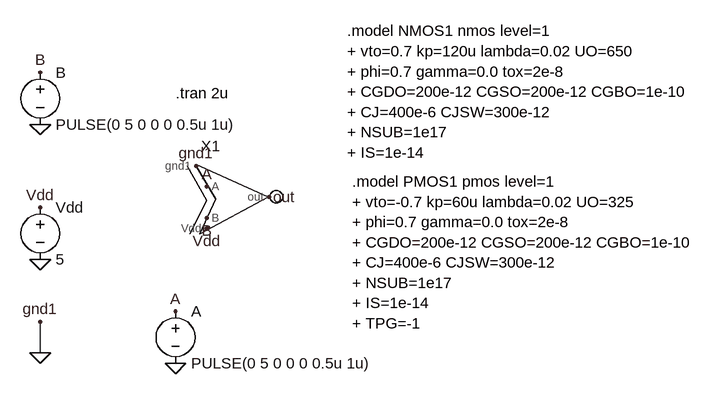
[diagram p0: schematic Draft15.asc]
Draft15.asc, the LTspice schematic file:
Version 4.1
SHEET 1 956 680
WIRE -80 416 -80 368
FLAG -80 416 0
FLAG -80 368 gnd1
FLAG -80 272 0
FLAG -80 64 0
FLAG 128 432 0
FLAG -80 -16 B
FLAG -80 192 Vdd
FLAG 128 352 A
FLAG 160 128 gnd1
FLAG 176 160 A
FLAG 176 208 B
FLAG 176 224 Vdd
FLAG 272 176 out
SYMBOL XORR 208 176 R0
SYMATTR InstName X1
SYMBOL voltage -80 -32 R0
WINDOW 123 0 0 Left 0
WINDOW 39 0 0 Left 0
SYMATTR InstName B
SYMATTR Value PULSE(0 5 0 0 0 0.5u 1u)
SYMBOL voltage -80 176 R0
WINDOW 123 0 0 Left 0
WINDOW 39 0 0 Left 0
SYMATTR InstName Vdd
SYMATTR Value 5
SYMBOL voltage 128 336 R0
WINDOW 123 0 0 Left 0
WINDOW 39 0 0 Left 0
SYMATTR InstName A
SYMATTR Value PULSE(0 5 0 0 0 0.5u 1u)
TEXT 392 -80 Left 2 !.model NMOS1 nmos level=1\n+ vto=0.7 kp=120u lambda=0.02 UO=650\n+ phi=0.7 gamma=0.0 tox=2e-8\n+ CGDO=200e-12 CGSO=200e-12 CGBO=1e-10\n+ CJ=400e-6 CJSW=300e-12\n+ NSUB=1e17\n+ IS=1e-14
TEXT 400 152 Left 2 !.model PMOS1 pmos level=1\n+ vto=-0.7 kp=60u lambda=0.02 UO=325\n+ phi=0.7 gamma=0.0 tox=2e-8\n+ CGDO=200e-12 CGSO=200e-12 CGBO=1e-10\n+ CJ=400e-6 CJSW=300e-12\n+ NSUB=1e17\n+ IS=1e-14\n+ TPG=-1
TEXT 128 16 Left 2 !.tran 2u

The netlist it stands for:
* Draft15.asc
X§X1 A B 0 out Vdd XORR  ; pins A B gnd1 out Vdd
V§B B 0 PULSE(0 5 0 0 0 0.5u 1u)
Vdd Vdd 0 5
V§A A 0 PULSE(0 5 0 0 0 0.5u 1u)
.model NMOS1 nmos level=1
+ vto=0.7 kp=120u lambda=0.02 UO=650
+ phi=0.7 gamma=0.0 tox=2e-8
+ CGDO=200e-12 CGSO=200e-12 CGBO=1e-10
+ CJ=400e-6 CJSW=300e-12
+ NSUB=1e17
+ IS=1e-14
.model PMOS1 pmos level=1
+ vto=-0.7 kp=60u lambda=0.02 UO=325
+ phi=0.7 gamma=0.0 tox=2e-8
+ CGDO=200e-12 CGSO=200e-12 CGBO=1e-10
+ CJ=400e-6 CJSW=300e-12
+ NSUB=1e17
+ IS=1e-14
+ TPG=-1
.tran 2u
.backanno
.end